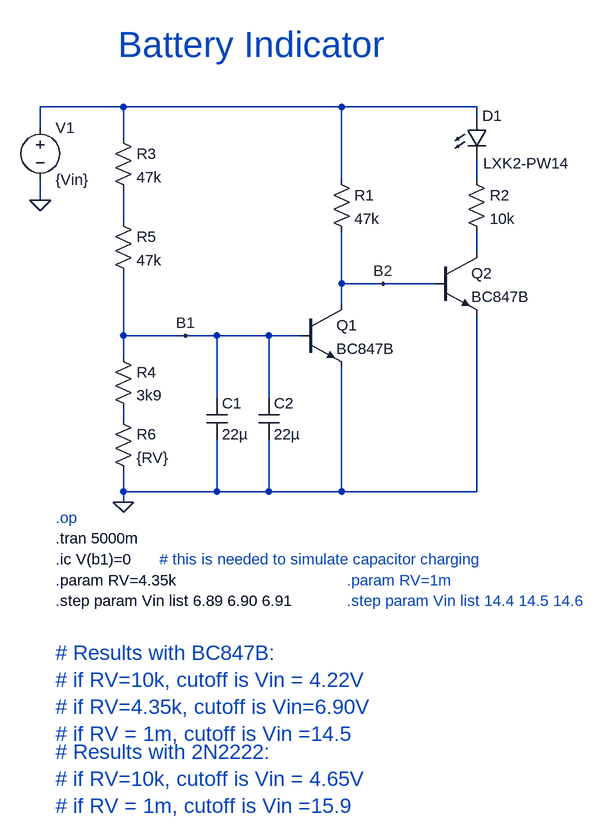
[diagram p0: schematic simulation-battery_indicator.asc]
simulation-battery_indicator.asc, the LTspice schematic file:
Version 4
SHEET 1 904 1156
WIRE 96 -64 -32 -64
WIRE 432 -64 96 -64
WIRE 640 -64 432 -64
WIRE 640 -48 640 -64
WIRE -32 -32 -32 -64
WIRE 96 -16 96 -64
WIRE 432 48 432 -64
WIRE 640 48 640 16
WIRE -32 80 -32 48
WIRE 96 112 96 64
WIRE 640 160 640 128
WIRE 432 208 432 128
WIRE 496 208 432 208
WIRE 576 208 496 208
WIRE 432 240 432 208
WIRE 96 288 96 192
WIRE 192 288 96 288
WIRE 240 288 192 288
WIRE 320 288 240 288
WIRE 368 288 320 288
WIRE 96 320 96 288
WIRE 240 384 240 288
WIRE 320 384 320 288
WIRE 96 416 96 400
WIRE 96 528 96 496
WIRE 240 528 240 448
WIRE 240 528 96 528
WIRE 320 528 320 448
WIRE 320 528 240 528
WIRE 432 528 432 336
WIRE 432 528 320 528
WIRE 640 528 640 256
WIRE 640 528 432 528
WIRE 96 544 96 528
FLAG 96 544 0
FLAG -32 80 0
FLAG 192 288 B1
FLAG 496 208 B2
SYMBOL npn 368 240 R0
SYMATTR InstName Q1
SYMATTR Value BC847B
SYMBOL npn 576 160 R0
SYMATTR InstName Q2
SYMATTR Value BC847B
SYMBOL Res 416 32 R0
SYMATTR InstName R1
SYMATTR Value 47k
SYMBOL Res 624 32 R0
SYMATTR InstName R2
SYMATTR Value 10k
SYMBOL Res 80 -32 R0
SYMATTR InstName R3
SYMATTR Value 47k
SYMBOL Res 80 304 R0
SYMATTR InstName R4
SYMATTR Value 3k9
SYMBOL Res 80 400 R0
SYMATTR InstName R6
SYMATTR Value {RV}
SYMBOL cap 224 384 R0
SYMATTR InstName C1
SYMATTR Value 22µ
SYMATTR SpiceLine Rser=0 Lser=0 mfg="   ---" pn="   ---" type="   ---"
SYMBOL LED 624 -48 R0
WINDOW 0 25 -2 Left 2
WINDOW 3 26 71 Left 2
SYMATTR InstName D1
SYMATTR Value LXK2-PW14
SYMBOL voltage -32 -48 R0
SYMATTR InstName V1
SYMATTR Value {Vin}
SYMBOL Res 80 96 R0
SYMATTR InstName R5
SYMATTR Value 47k
SYMBOL cap 304 384 R0
SYMATTR InstName C2
SYMATTR Value 22µ
SYMATTR SpiceLine Rser=0 Lser=0 mfg="   ---" pn="   ---" type="   ---"
TEXT -8 568 Left 2 ;.op
TEXT -8 600 Left 2 !.tran 5000m
TEXT -8 632 Left 2 !.ic V(b1)=0
TEXT 88 -160 Left 5 ;Battery Indicator
TEXT -8 664 Left 2 !.param RV=4.35k
TEXT 152 632 Left 2 ;# this is needed to simulate capacitor charging
TEXT -8 696 Left 2 !.step param Vin list 6.89 6.90 6.91
TEXT -8 928 Left 3 ;# Results with 2N2222:\n# if RV=10k, cutoff is Vin = 4.65V \n# if RV = 1m, cutoff is Vin =15.9
TEXT -8 776 Left 3 ;# Results with BC847B:\n# if RV=10k, cutoff is Vin = 4.22V \n# if RV=4.35k, cutoff is Vin=6.90V\n# if RV = 1m, cutoff is Vin =14.5
TEXT 440 664 Left 2 ;.param RV=1m
TEXT 440 696 Left 2 ;.step param Vin list 14.4 14.5 14.6

The netlist it stands for:
* simulation-battery_indicator.asc
Q1 B2 B1 0 0 BC847B
Q2 N004 B2 0 0 BC847B
R1 N001 B2 47k
R2 N002 N004 10k
R3 N001 N003 47k
R4 B1 N005 3k9
R6 N005 0 {RV}
C1 B1 0 22µ Rser=0 Lser=0 mfg="   ---" pn="   ---" type="   ---"
D1 N001 N002 LXK2-PW14
V1 N001 0 {Vin}
R5 N003 B1 47k
C2 B1 0 22µ Rser=0 Lser=0 mfg="   ---" pn="   ---" type="   ---"
.model D D
.lib standard.dio
.model NPN NPN
.model PNP PNP
.lib standard.bjt
* .op
.tran 5000m
.ic V(b1)=0
* Battery Indicator
.param RV=4.35k
* # this is needed to simulate capacitor charging
.step param Vin list 6.89 6.90 6.91
* # Results with 2N2222:
* # if RV=10k, cutoff is Vin = 4.65V
* # if RV = 1m, cutoff is Vin =15.9
* # Results with BC847B:
* # if RV=10k, cutoff is Vin = 4.22V
* # if RV=4.35k, cutoff is Vin=6.90V
* # if RV = 1m, cutoff is Vin =14.5
* .param RV=1m
* .step param Vin list 14.4 14.5 14.6
.backanno
.end